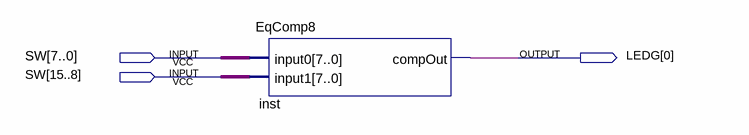
[diagram p0: schematic sheet]
// Quartus schematic EqComp8.bdf as structural Verilog: 1 symbols, 3 pins
module EqComp8 (
  input  [15:0] SW,
  output [0:0] LEDG
);

  EqComp8 inst (.input0(SW[7:0]), .input1(SW[15:8]), .compOut(LEDG[0]));
endmodule
